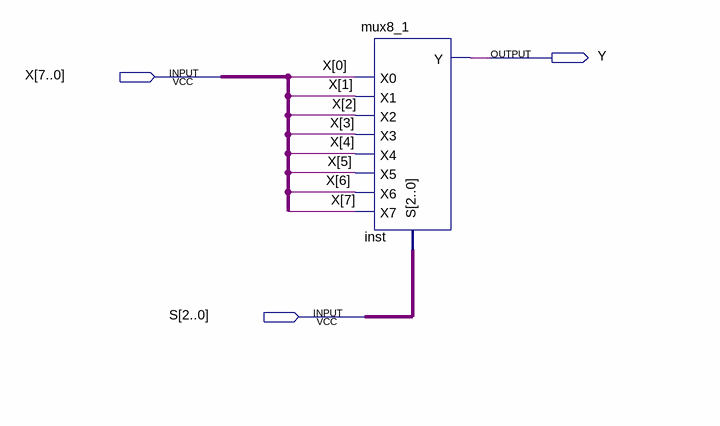
[diagram p0: schematic sheet]
// Quartus schematic TesteSim1.bdf as structural Verilog: 1 symbols, 3 pins
module TesteSim1 (
  input  [7:0] X,
  input  [2:0] S,
  output Y
);

  mux8_1 inst (.S(S), .X0(X[0]), .X1(X[1]), .X2(X[2]), .X3(X[3]), .X4(X[4]), .X5(X[5]), .X6(X[6]), .X7(X[7]), .Y(Y));
endmodule
